# Altium schematic sheet LightLink_V3.SchDoc
size C; SheetNumber: 1; SheetTotal: 6
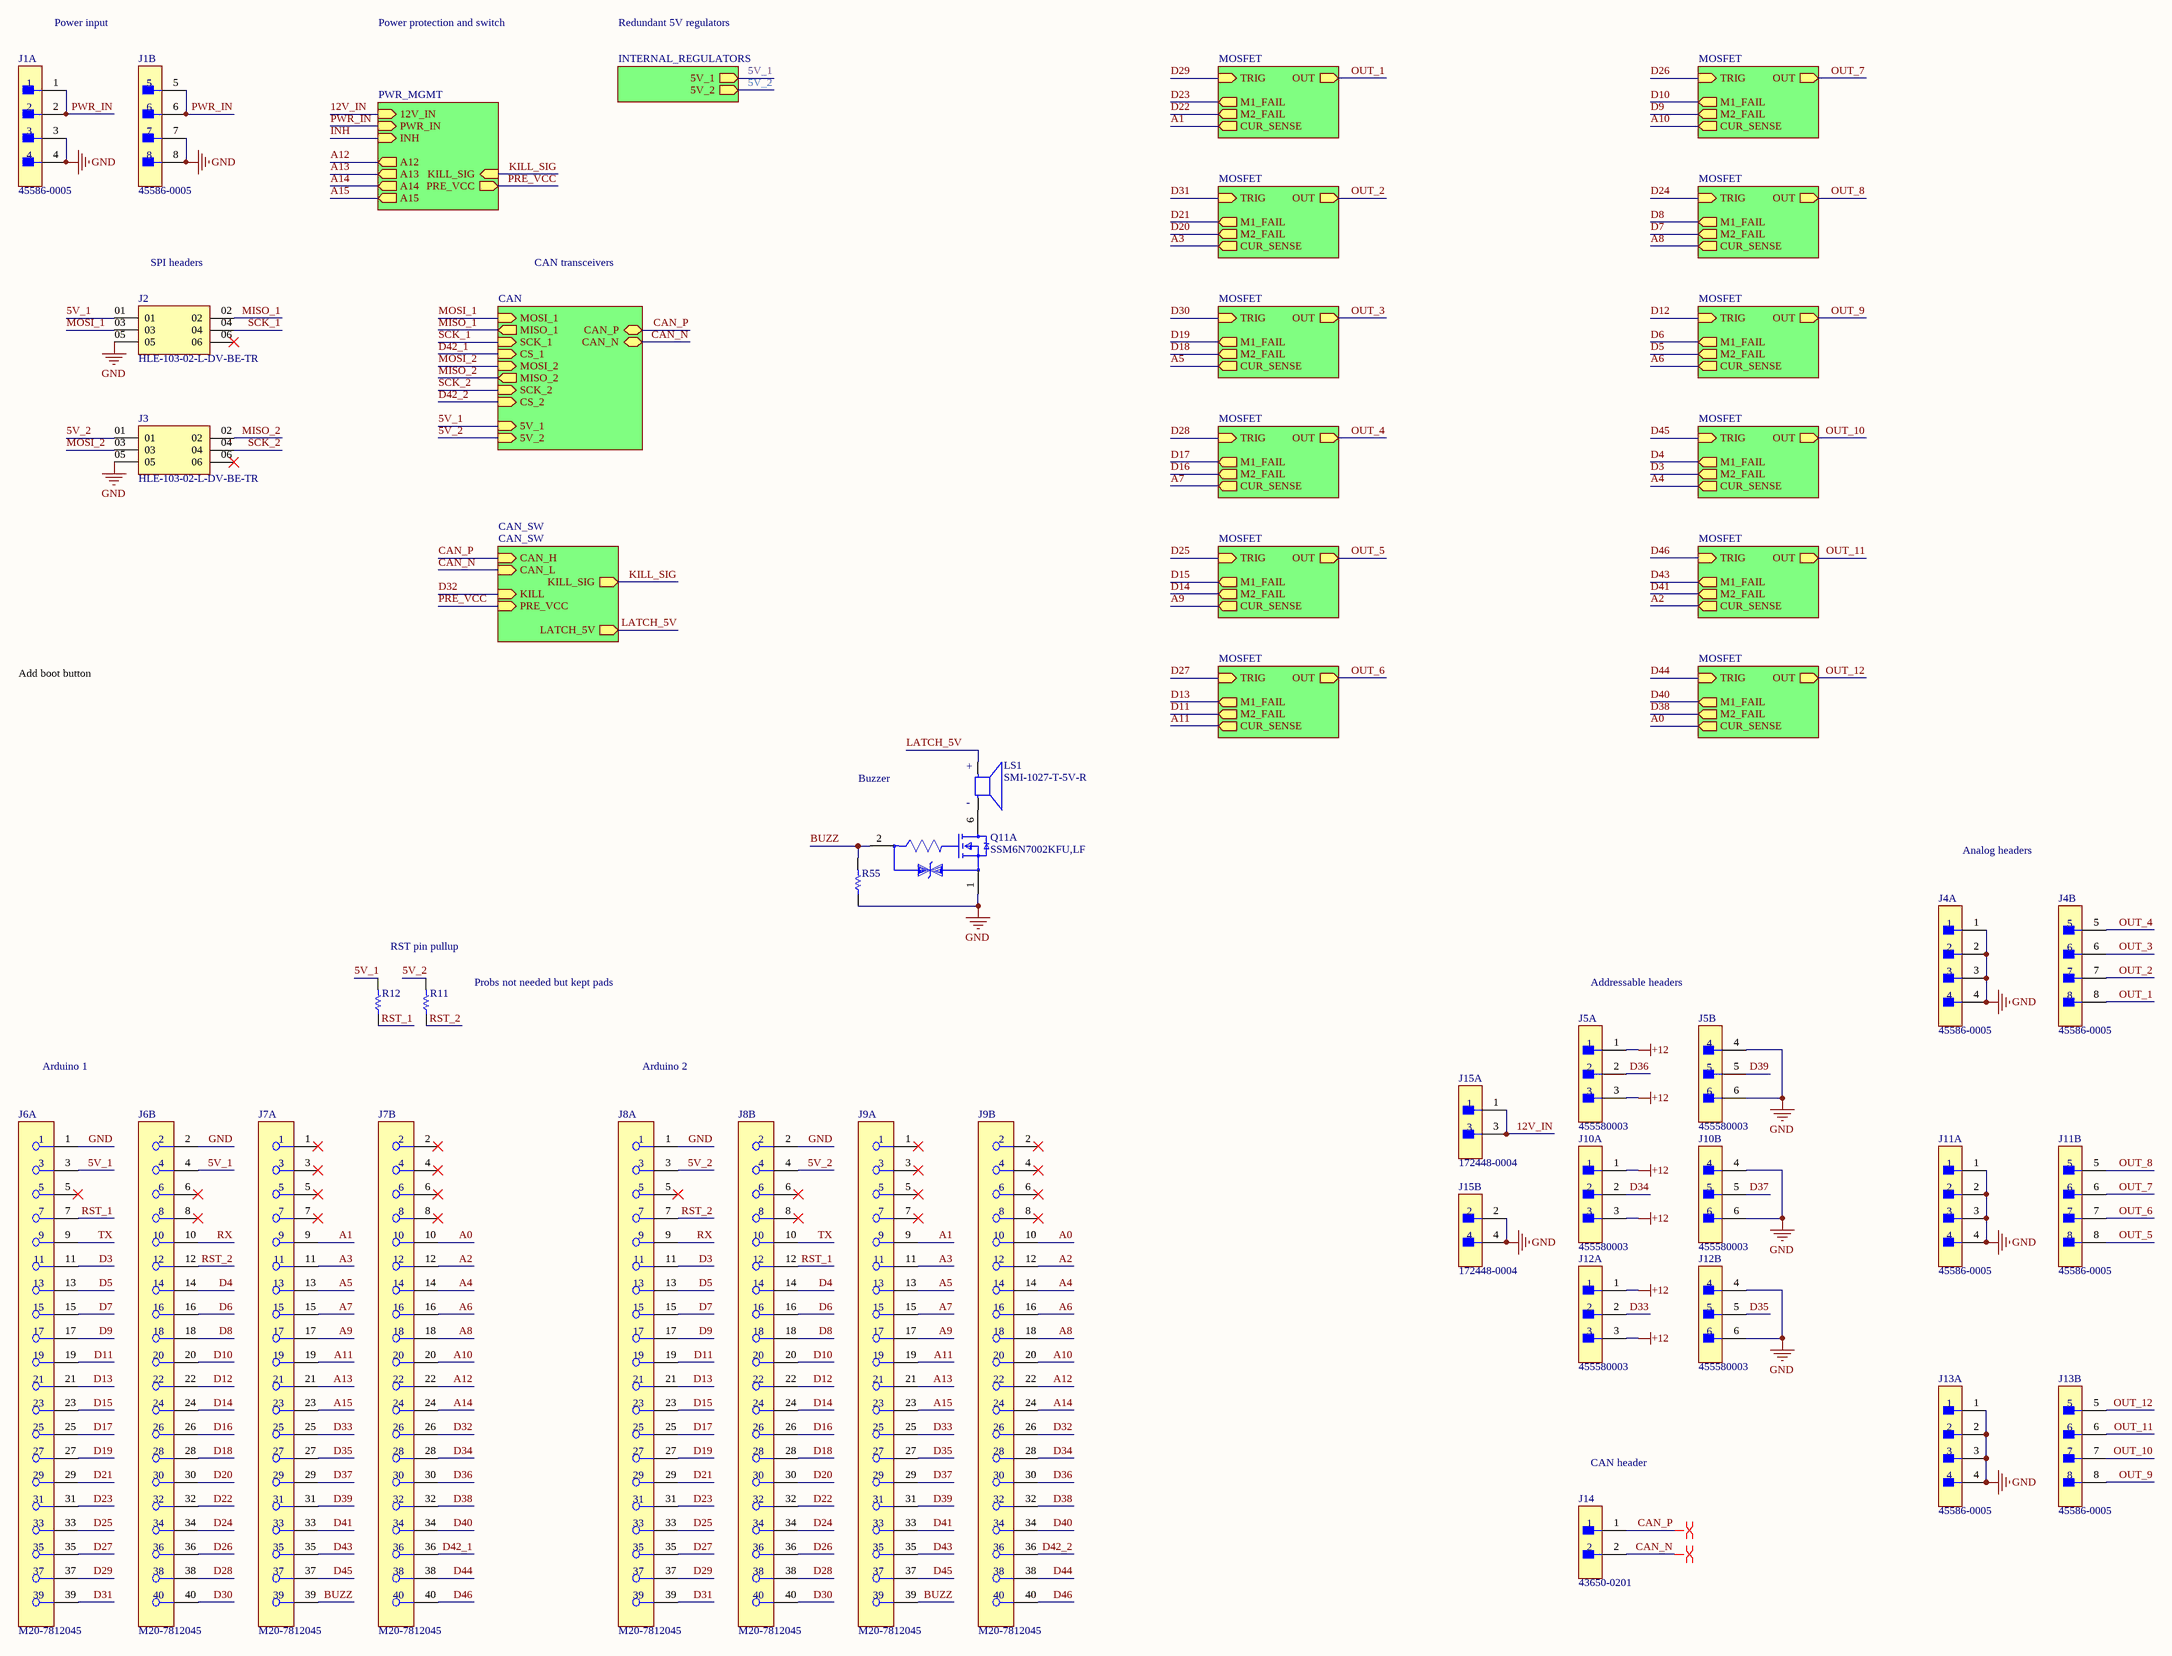
[diagram p0: LightLink_V3.SchDoc]

## Parts
J1  45586-0005  [FP-45586-0005-MFG]  (parts A,B of 2)
J2  HLE-103-02-L-DV-BE-TR  [SAMTEC_HLE-103-02-L-DV-BE-TR]
J3  HLE-103-02-L-DV-BE-TR  [SAMTEC_HLE-103-02-L-DV-BE-TR]
J4  45586-0005  [FP-45586-0005-MFG]  (parts A,B of 2)
J5  455580003  [FP-455580003-MFG]  (parts A,B of 2)
J6  M20-7812045  [FP-M20-7812045-MFG]  (parts A,B of 2)
J7  M20-7812045  [FP-M20-7812045-MFG]  (parts A,B of 2)
J8  M20-7812045  [FP-M20-7812045-MFG]  (parts A,B of 2)
J9  M20-7812045  [FP-M20-7812045-MFG]  (parts A,B of 2)
J10  455580003  [FP-455580003-MFG]  (parts A,B of 2)
J11  45586-0005  [FP-45586-0005-MFG]  (parts A,B of 2)
J12  455580003  [FP-455580003-MFG]  (parts A,B of 2)
J13  45586-0005  [FP-45586-0005-MFG]  (parts A,B of 2)
J14  43650-0201  [FP-43650-0201-MFG]
J15  172448-0004  [FP-39-30-1041-MFG]  (parts A,B of 2)
LS1  SMI-1027-T-5V-R  [SMI-1027-T-5V-R-Footprint-1]
Q11  SSM6N7002KFU,LF  [FP-SSOP6-P-0_65A-MFG]  (part A of 2)
R11  ERJ3EKF1002V  [RESC1609X55X30LL15T15]  (value not drawn)
R12  ERJ3EKF1002V  [RESC1609X55X30LL15T15]  (value not drawn)
R55  ERJ3EKF1002V  [RESC1609X55X30LL15T15]  (value not drawn)

## Sub-sheets
CAN = CAN: CAN_P (bidir), CAN_N (bidir), CS_1 (in), CS_2 (in), MOSI_1 (in), MISO_1 (out), SCK_1 (in), MOSI_2 (in), MISO_2 (out), SCK_2 (in), 5V_1 (in), 5V_2 (in)
CAN_SW = CAN_SW: CAN_H (in), CAN_L (in), KILL (in), KILL_SIG (out), PRE_VCC (in), LATCH_5V (out)
INTERNAL_REGULATORS = INTERNAL_REGULATORS: 5V_1 (out), 5V_2 (out)
M = MOSFET: TRIG (in), OUT (out), M2_FAIL (out), M1_FAIL (out), CUR_SENSE (out)
M = MOSFET: TRIG (in), OUT (out), M2_FAIL (out), M1_FAIL (out), CUR_SENSE (out)
M = MOSFET: TRIG (in), OUT (out), M2_FAIL (out), M1_FAIL (out), CUR_SENSE (out)
M = MOSFET: TRIG (in), OUT (out), M2_FAIL (out), M1_FAIL (out), CUR_SENSE (out)
M = MOSFET: TRIG (in), OUT (out), M2_FAIL (out), M1_FAIL (out), CUR_SENSE (out)
M = MOSFET: TRIG (in), OUT (out), M2_FAIL (out), M1_FAIL (out), CUR_SENSE (out)
M = MOSFET: TRIG (in), OUT (out), M2_FAIL (out), M1_FAIL (out), CUR_SENSE (out)
M = MOSFET: TRIG (in), OUT (out), M2_FAIL (out), M1_FAIL (out), CUR_SENSE (out)
M = MOSFET: TRIG (in), OUT (out), M2_FAIL (out), M1_FAIL (out), CUR_SENSE (out)
M = MOSFET: TRIG (in), OUT (out), M2_FAIL (out), M1_FAIL (out), CUR_SENSE (out)
M = MOSFET: TRIG (in), OUT (out), M2_FAIL (out), M1_FAIL (out), CUR_SENSE (out)
M = MOSFET: TRIG (in), OUT (out), M2_FAIL (out), M1_FAIL (out), CUR_SENSE (out)
PWR_MGMT = PWR_MGMT: PWR_IN (in), INH (in), A13 (out), A12 (out), PRE_VCC (out), KILL_SIG (in), A14 (out), A15 (out), 12V_IN (in)

## Nets
+12: J5.1 J5.3 J10.1 J10.3 J12.1 J12.3
GND: J1.3 J1.4 J1.7 J1.8 J2.05 J3.05 J4.1 J4.2 J4.3 J4.4 J5.4 J5.6 J6.1 J6.2 J8.1 J8.2 J10.4 J10.6 J11.1 J11.2 J11.3 J11.4 J12.4 J12.6 J13.1 J13.2 J13.3 J13.4 J15.2 J15.4 Q11.1(Source1) R55.1
5V_1: J2.01 J6.3 J6.4 R12.2 ; sheet CAN/5V_1, sheet INTERNAL_REGULATORS/5V_1
5V_2: J3.01 J8.3 J8.4 R11.2 ; sheet CAN/5V_2, sheet INTERNAL_REGULATORS/5V_2
12V_IN: J15.1 J15.3 ; sheet PWR_MGMT/12V_IN
A0: J7.10 J9.10 ; sheet M/CUR_SENSE
A1: J7.9 J9.9 ; sheet M/CUR_SENSE
A2: J7.12 J9.12 ; sheet M/CUR_SENSE
A3: J7.11 J9.11 ; sheet M/CUR_SENSE
A4: J7.14 J9.14 ; sheet M/CUR_SENSE
A5: J7.13 J9.13 ; sheet M/CUR_SENSE
A6: J7.16 J9.16 ; sheet M/CUR_SENSE
A7: J7.15 J9.15 ; sheet M/CUR_SENSE
A8: J7.18 J9.18 ; sheet M/CUR_SENSE
A9: J7.17 J9.17 ; sheet M/CUR_SENSE
A10: J7.20 J9.20 ; sheet M/CUR_SENSE
A11: J7.19 J9.19 ; sheet M/CUR_SENSE
A12: J7.22 J9.22 ; sheet PWR_MGMT/A12
A13: J7.21 J9.21 ; sheet PWR_MGMT/A13
A14: J7.24 J9.24 ; sheet PWR_MGMT/A14
A15: J7.23 J9.23 ; sheet PWR_MGMT/A15
BUZZ: J7.39 J9.39 Q11.2(Gate1) R55.2
CAN_N: J14.2 ; sheet CAN/CAN_N, sheet CAN_SW/CAN_L
CAN_P: J14.1 ; sheet CAN/CAN_P, sheet CAN_SW/CAN_H
D3: J6.11 J8.11 ; sheet M/M2_FAIL
D4: J6.14 J8.14 ; sheet M/M1_FAIL
D5: J6.13 J8.13 ; sheet M/M2_FAIL
D6: J6.16 J8.16 ; sheet M/M1_FAIL
D7: J6.15 J8.15 ; sheet M/M2_FAIL
D8: J6.18 J8.18 ; sheet M/M1_FAIL
D9: J6.17 J8.17 ; sheet M/M2_FAIL
D10: J6.20 J8.20 ; sheet M/M1_FAIL
D11: J6.19 J8.19 ; sheet M/M2_FAIL
D12: J6.22 J8.22 ; sheet M/TRIG
D13: J6.21 J8.21 ; sheet M/M1_FAIL
D14: J6.24 J8.24 ; sheet M/M2_FAIL
D15: J6.23 J8.23 ; sheet M/M1_FAIL
D16: J6.26 J8.26 ; sheet M/M2_FAIL
D17: J6.25 J8.25 ; sheet M/M1_FAIL
D18: J6.28 J8.28 ; sheet M/M2_FAIL
D19: J6.27 J8.27 ; sheet M/M1_FAIL
D20: J6.30 J8.30 ; sheet M/M2_FAIL
D21: J6.29 J8.29 ; sheet M/M1_FAIL
D22: J6.32 J8.32 ; sheet M/M2_FAIL
D23: J6.31 J8.31 ; sheet M/M1_FAIL
D24: J6.34 J8.34 ; sheet M/TRIG
D25: J6.33 J8.33 ; sheet M/TRIG
D26: J6.36 J8.36 ; sheet M/TRIG
D27: J6.35 J8.35 ; sheet M/TRIG
D28: J6.38 J8.38 ; sheet M/TRIG
D29: J6.37 J8.37 ; sheet M/TRIG
D30: J6.40 J8.40 ; sheet M/TRIG
D31: J6.39 J8.39 ; sheet M/TRIG
D32: J7.26 J9.26 ; sheet CAN_SW/KILL
D33: J7.25 J9.25 J12.2
D34: J7.28 J9.28 J10.2
D35: J7.27 J9.27 J12.5
D36: J5.2 J7.30 J9.30
D37: J7.29 J9.29 J10.5
D38: J7.32 J9.32 ; sheet M/M2_FAIL
D39: J5.5 J7.31 J9.31
D40: J7.34 J9.34 ; sheet M/M1_FAIL
D41: J7.33 J9.33 ; sheet M/M2_FAIL
D42_1: J7.36 ; sheet CAN/CS_1
D42_2: J9.36 ; sheet CAN/CS_2
D43: J7.35 J9.35 ; sheet M/M1_FAIL
D44: J7.38 J9.38 ; sheet M/TRIG
D45: J7.37 J9.37 ; sheet M/TRIG
D46: J7.40 J9.40 ; sheet M/TRIG
INH: sheet PWR_MGMT/INH
KILL_SIG: sheet PWR_MGMT/KILL_SIG, sheet CAN_SW/KILL_SIG
LATCH_5V: LS1.LOAD+(POS) ; sheet CAN_SW/LATCH_5V
MISO_1: J2.02 ; sheet CAN/MISO_1
MISO_2: J3.02 ; sheet CAN/MISO_2
MOSI_1: J2.03 ; sheet CAN/MOSI_1
MOSI_2: J3.03 ; sheet CAN/MOSI_2
OUT_1: J4.8 ; sheet M/OUT
OUT_2: J4.7 ; sheet M/OUT
OUT_3: J4.6 ; sheet M/OUT
OUT_4: J4.5 ; sheet M/OUT
OUT_5: J11.8 ; sheet M/OUT
OUT_6: J11.7 ; sheet M/OUT
OUT_7: J11.6 ; sheet M/OUT
OUT_8: J11.5 ; sheet M/OUT
OUT_9: J13.8 ; sheet M/OUT
OUT_10: J13.7 ; sheet M/OUT
OUT_11: J13.6 ; sheet M/OUT
OUT_12: J13.5 ; sheet M/OUT
PRE_VCC: sheet PWR_MGMT/PRE_VCC, sheet CAN_SW/PRE_VCC
PWR_IN: J1.1 J1.2 J1.5 J1.6 ; sheet PWR_MGMT/PWR_IN
RST_1: J6.7 J8.12 R12.1
RST_2: J6.12 J8.7 R11.1
RX: J6.10 J8.9
SCK_1: J2.04 ; sheet CAN/SCK_1
SCK_2: J3.04 ; sheet CAN/SCK_2
TX: J6.9 J8.10
NetLS1_LOAD-: LS1.LOAD-(NEG) Q11.6(Drain1)

Not connected (* = marked no-connect by the designer): J2 06*; J3 06*; J6 5* 6* 8*; J7 1* 2* 3* 4* 5* 6* 7* 8*; J8 5* 6* 8*; J9 1* 2* 3* 4* 5* 6* 7* 8*

## Layout directives
differential pair: CAN_N, CAN_P

## Notes on the sheet
- Power input
- Power protection and switch
- Redundant 5V regulators
- SPI headers
- CAN transceivers
- Add boot button
- Buzzer
- Analog headers
- RST pin pullup
- Probs not needed but kept pads
- Addressable headers
- Arduino 1
- Arduino 2
- CAN header
- (in symbol CMP-00027-00002-1) +; -

## Library data of the parts
J1 J4 J11 J13 = CMP-04776-000690-1: CONN HEADER R/A 8POS 4.2MM
J2 J3 = CMP-020-000000-4: MF: Samtec; Availability: Unavailable; Package: None; Component Type: Standard; MP: HLE-103-02-L-DV-BE-TR; Pin Count: 6; Design Item ID: HLE-103-02-L-DV-BE-TR; Value: *; Price: None; Source: HLE-103-02-L-DV-BE-TR.SchLib
J5 J10 J12 = CMP-04776-000024-1: CONN HEADER R/A 6POS 4.2MM; Manufacturer: Molex; Standoff Height: 0.4mm; Conn Orientation: Right Angle; Number Of Contacts: 6; Conn Gender: Male; Voltage Rating: 600V; Current Rating: 8A; Footprint Url: https://www.molex.com/pdm_docs/sd/455580003_sd.pdf; Number Of Rows: 2; Lead Free: Yes; Digikey Description: CONN HEADER R/A 6POS 4.2MM; ComponentLink2URL: https://www.molex.com/webdocs/datasheets/pdf/en-us/0455580003_PCB_HEADERS.pdf; Octopart: https://octopart.com/45558-0003-molex-7672845; Package: 0; Device Class L3: unset; ComponentLink2Description: Datasheet; Device Class L2: Headers and Wire Housings; Category: Conn; Contact Material: Tin,Nickel; Mouser Description: Conn Power HDR 6 POS 4.2mm Solder ST Thru-Hole 6 Terminal 1 Port Mini-Fit Jr™ Tray; Manufacturer Part Number: 455580003; Pitch: 4.2mm; Device Class L1: Connectors; Temperature Range Low: -40°C; Temperature: -40°C to +105°C; RoHS: TRUE; Temperature Range High: +105°C; Height: 10.38mm; Automotive: No
J6-J9 = CMP-15831-000026-1: CONN RCPT 40POS 0.1 GOLD SMD; Current Rating: 3A; Number of Positions: 40; Connector Type: Receptacle; Max Operating Temperature: 105°C; Flammability Rating: UL94 V-0; Contact Material: Bronze; Number of Rows: 2; Fastening Type: Push; Insulation Color: Black; Mount: Surface Mount; Contact Shape: Square; Termination: Solder; Packaging: Rail/Tube; Contact Plating: Gold; Min Operating Temperature: -40°C; Insulation Material: Nylon
J14 = CMP-04776-000557-1: CONN HEADER R/A 2POS 3MM; Voltage Rating: 600V; Number of Circuits: 2; Insulation Resistance: 1GR; Current Rating: 5A; Voltage Rating (DC): 250V; Contact Resistance: 10mR; Gender: Male; Number of Ports: 1; Glow Wire Compliant: Compliant; Pitch: 3mm; Contact Plating: Gold; Series: 43650; Color: Black; Max Operating Temperature: 105°C; Radiation Hardening: No; Orientation: Right Angle; Number of Terminals/Pins: 2; Length: 9.65mm; Case/Package: 0201; Halogen Free: Low Halogen; Housing Color: Black; Min Operating Temperature: -40°C; Package Quantity: 3927; Contact Material: Brass; Number of Rows: 1; Number of Positions: 2; Termination: Solder; Depth: 9.9mm; Mount: Through Hole; Packaging: Tray; Number of Contacts: 2; Housing Material: Thermoplastic; Flammability Rating: UL94 V-0
J15 = CMP-04776-000047-1: Different component but holes should line up. Original P/N is 39-30-1041; Manufacturer: Molex; Old_Part_Number: 5569-04A2G; Keying_to_Mating_Part: None; Circuits_maximum: 4; First_Mate__Last_Break: No; Lead_freeProcess_Capability: WAVE; Duration_at_Max_Process_Temperature_seconds: 005; Sales_Drawing: SDA-5569-NA2*-*; Current Rating: 13A; Material___Plating_Mating: Gold; Conn Gender: Male; Test_Summary: TS-5556-002; Color___Resin: Natural; Termination_Interface_Style: Through Hole; Pitch___Termination_Interface: 4.20mm; UL: E29179; PCB_Retention: Yes; Product_Name: Mini-Fit Jr.TM; Material___Resin: Nylon; Overview: Mini-Fit Jr. Power Connectors; CSA: LR19980; Plating_min___Termination: 2.540μm; Packaging_Type: Bag; Number_of_Rows: 2; Durability_mating_cycles_max: 30; Max_Cycles_at_Max_Process_Temperature: 001; Product_Specification: PS-45750-001, PS-5556-001; Net_Weight: 1.529/g; Voltage___Maximum: 600V; Material___Metal: Brass; Pitch: 4.2mm; Packaging_Specification: PK-5569-002; Shrouded: Fully; Plating_min___Mating: 0.762μm; Temperature_Range___Operating: -40°C to +105°C; Current___Maximum_per_Contact: 13.0A; Comments: Current = 13A max. per circuit when header is mated to a receptacle loaded with  45750  Mini-Fit® Plus HCS Crimp Terminal Crimped to 16 AWG wire.,  See Molex Product specification PS-5556-001 for additional current de-rating information.; Process_Temperature_max_C: 240; PCB_Thickness___Recommended: 1.78mm; Standoff Height: 0.016inch; Surface_Mount_Compatible_SMC: No; UPC: 800753579651; Conn Orientation: Right Angle; Material___Plating_Termination: Matte Tin; ComponentLink2Description: Datasheet; Footprint Url: https://www.molex.com/pdm_docs/sd/039301041_sd.pdf; Contact Material: Gold,Nickel; Octopart: https://octopart.com/39-30-1041-molex-276737; Digikey Description: CONN HEADER R/A 4POS 4.2MM; imported: yes; Series: 5569; Mouser Description: Headers & Wire Housings 4 CKT R/A HEADER; Temperature Range High: +105°C; Category: Conn; Polarized_to_Mating_Part: Yes; Pitch___Mating_Interface: 4.20mm; Automotive: No; Guide_to_Mating_Part: No; Lock_to_Mating_Part: Yes; Number Of Contacts: 4; Temperature Range Low: -40°C; RoHS: TRUE; Status: Active; imported_from: 3D Model; ComponentLink2URL: http://www.molex.com/pdm_docs/sd/039301041_sd.pdf; part_page: http://www.molex.com/molex/products/datasheet.jsp?part=active/0039301041_PCB_HEADERS.xml; Temperature: -40°C to +105°C; Device Class L3: unset; Device Class L1: Connectors; Package: 39-30-1041; Circuits_Loaded: 4; Lead Free: Yes; Ipc Land Pattern Name: CAPAD1016W80L630D240; Application: Power, Wire-to-Board; Voltage Rating: 600V; Manufacturer Part Number: 39-30-1041; Breakaway: No; Orientation: Right Angle; Flammability: 94V-2; 3D_model: http://www.molex.com/pdm_docs/stp/39-30-1041_stp.zip; Number Of Rows: 2; Polarized_to_PCB: Yes; Device Class L2: Headers and Wire Housings; Glow_Wire_Compliant: No; Stackable: No; PCB_Locator: Yes
LS1 = CMP-00027-00002-1: Audio Ind Magnt 5V 9.6X9.6MM SMD
Q11 = CMP-35916-000009-1: MOSFET 2N-CH 60V 0.3A; Input Capacitance: 40pF; Continuous Drain Current (ID): 300mA; Max Power Dissipation: 285mW; FET Type: 2 N-Channel; Rds On Max: 1.5R; Mount: Surface Mount; Drain to Source Voltage (Vdss): 60V; Packaging: Tape and Reel
R11 R12 R55 = CMP-1012-00623-3: Chip Resistor, 10 KOhm, +/- 1%, 0.1 W, -55 to 155 degC, 0603 (1608 Metric), RoHS, Tape and Reel; Manufacturer: Panasonic; Voltage Rating: 75V; Case\/Package: 0603; Power Rating: 100mW; Resistance: 10KOhm; Temperature Coefficient: 100ppm\/degreesC; Number of Pins: 2; Package Reference: 603; Depth: 0.8mm; Mount: SurfaceMount; Package Description: 2-Pin Surface Mount Device, Body 1.6 x 0.85 mm; Datasheet Version: 02/2017; Length: 1.6mm; Lead Free: LeadFree; Height: 0.45mm; Number of Terminations: 2; Max Power Dissipation: 100mW; Min Operating Temperature: -55degC; Datasheet URL: https://industrial.panasonic.com/cdbs/www-data/pdf/RDA0000/AOA0000C304.pdf; Termination: SMD/SMT; Case Code (Metric): 1608; Case Code (Imperial): 0603; Tolerance: 1%; Max Operating Temperature: 155degC; RoHSCompliant: true; Voltage Rating (DC): 75V; Radiation Hardening: No; Packaging: TapeandReel; Composition: ThickFilm; Mounting Technology: SurfaceMount; Manufacturer URL: http://www.panasonic.com/; Width: 0.031inch; REACH SVHC: NoSVHC; Contact Plating: Tin; Military Standard: Not; Package Quantity: 1